# Altium project KorszeOBD.PrjPcb
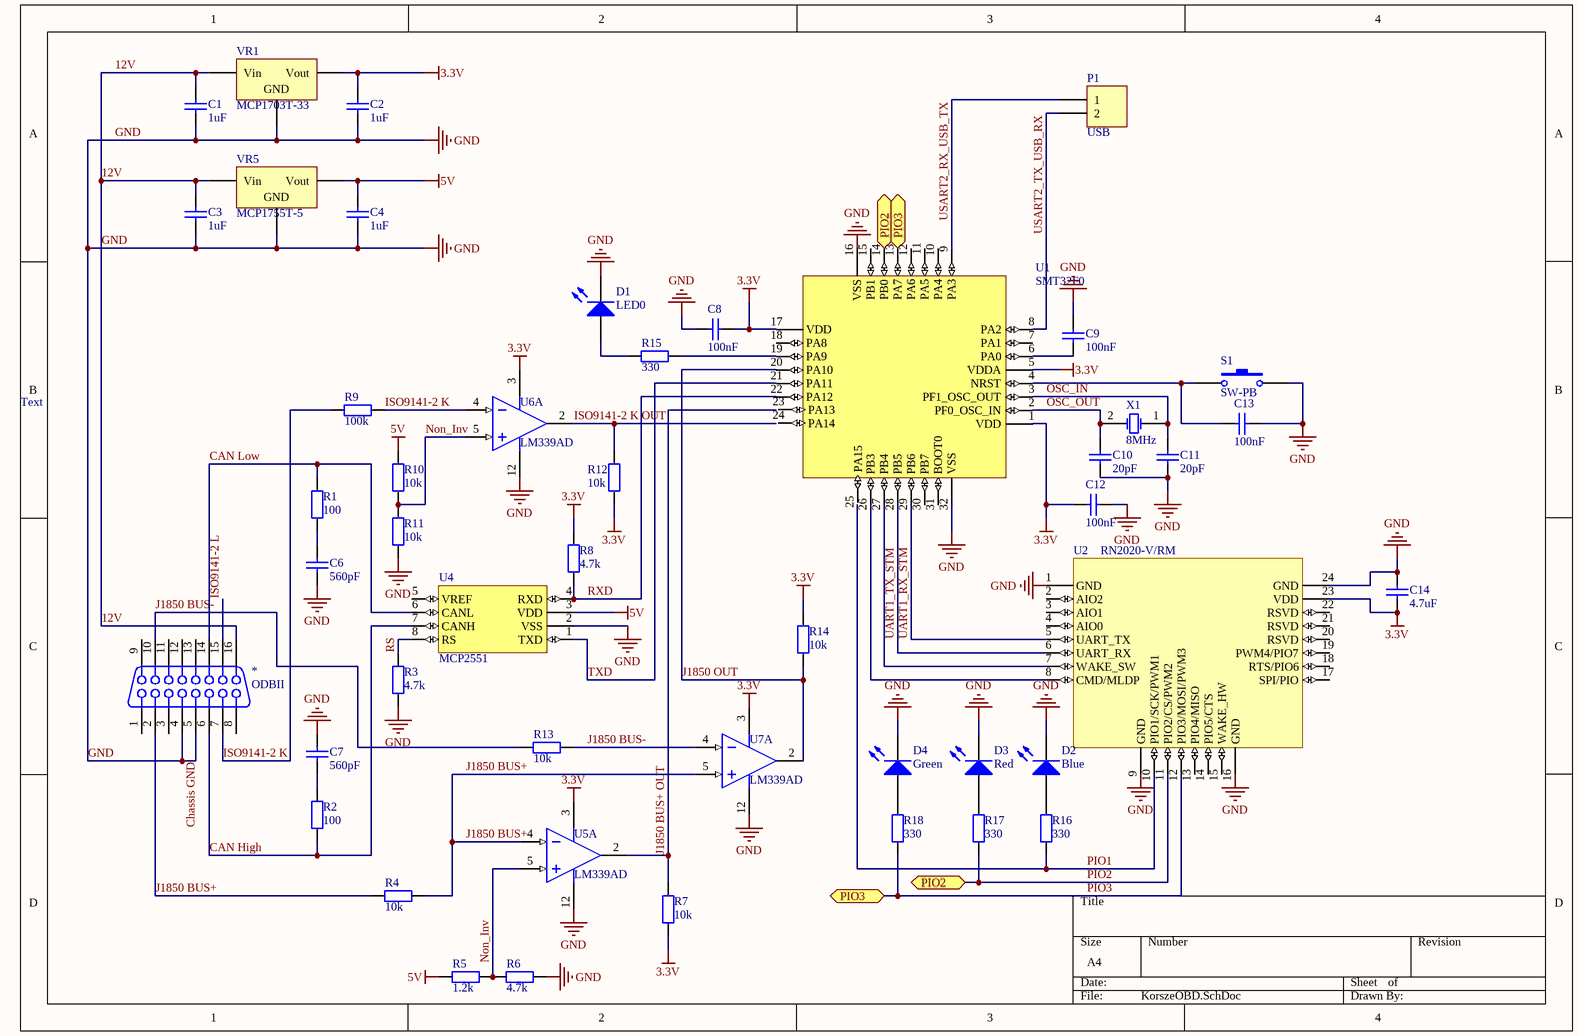
[diagram p0: KorszeOBD.SchDoc]
1 sheet, 47 parts. Net scope: flat (ports and power ports of the same name join across sheets).
Board file: KorszeOBD.PcbDoc

## Sheet KorszeOBD.SchDoc
size A4

### Parts
*  ODBII  [HDR2X8H]
C1  1uF  [0402]
C2  1uF  [0402]
C3  1uF  [0402]
C4  1uF  [0402]
C6  560pF  [0402]
C7  560pF  [0402]
C8  100nF  [0402]
C9  100nF  [0402]
C10  20pF  [0402]
C11  20pF  [0402]
C12  100nF  [0402]
C13  100nF  [0402]
C14  4.7uF  [0402]
D1  LED0  [3.2X1.6X1.1]
D2  Blue  [3.2X1.6X1.1]
D3  Red  [3.2X1.6X1.1]
D4  Green  [3.2X1.6X1.1]
P1  USB  [HDR1X2H]
R1  100  [J1-0603]
R2  100  [J1-0603]
R3  4.7k  [J1-0603]
R4  10k  [J1-0603]
R5  1.2k  [J1-0603]
R6  4.7k  [J1-0603]
R7  10k  [J1-0603]
R8  4.7k  [J1-0603]
R9  100k  [J1-0603]
R10  10k  [J1-0603]
R11  10k  [J1-0603]
R12  10k  [J1-0603]
R13  10k  [J1-0603]
R14  10k  [J1-0603]
R15  330  [J1-0603]
R16  330  [J1-0603]
R17  330  [J1-0603]
R18  330  [J1-0603]
S1  SW-PB  [SPST-2]
U1  SMT32F0  [Model Name]
U2  RN2020-V/RM  [RN4020 MODULE-24]
U4  MCP2551  [SO8W_M]
U5  LM339AD  [SO14_M]  (part A of 4)
U6  LM339AD  [SO14_M]  (part A of 4)
U7  LM339AD  [SO14_M]  (part A of 4)
VR1  MCP1703T-33  [SOT-23_M]
VR5  MCP1755T-5  [SOT23-6_M]
X1  8MHz  [R38]

### Ports
PIO2, PIO3

### Nets
3.3V: C2.2 C8.2 C12.2 C14.1 R7.2 R8.1 R12.2 R14.2 U1.1(VDD) U1.5(VDDA) U1.17(VDD) U2.23(VDD) U5.3(V+) U6.3(V+) U7.3(V+) VR1.3(Vout)
5V: C4.2 R5.2 R10.2 U4.3(VDD) VR5.3(Vout)
12V: *.4 *.5 *.16 C1.1 C1.2 C2.1 C3.1 C3.2 C4.1 C6.1 C7.2 C8.1 C9.2 C10.2 C11.2 C12.1 C13.2 C14.2 D1.2(K) D2.2(K) D3.2(K) D4.2(K) R3.1 R6.1 R11.1 S1.2 U1.16(VSS) U1.32(VSS) U2.1(GND) U2.9(GND) U2.16(GND) U2.24(GND) U4.2(VSS) U5.12(V-) U6.12(V-) U7.12(V-) VR1.1(Vin) VR1.2(GND) VR5.1(Vin) VR5.2(GND)  [also labelled Chassis GND, GND]
CAN High: *.6 R2.1 U4.7(CANH)
CAN Low: *.14 R1.2 U4.6(CANL)
ISO9141-2 K: *.7 R9.1 R9.2 U6.4(IN-)
ISO9141-2 K OUT: R12.1 U6.2(OUT)
ISO9141-2 L: *.15
J1850 BUS+: *.2 R4.1 R4.2 U5.4(IN-) U7.5(IN+)
J1850 BUS+ OUT: R7.1 U5.2(OUT)
J1850 BUS-: *.10 R13.1 R13.2 U7.4(IN-)
J1850 OUT: R14.1 U1.20(PA10) U7.2(OUT)
Non_Inv: R5.1 R6.2 R10.1 R11.2 U5.5(IN+) U6.5(IN+)
OSC_IN: C11.1 U1.3(PF1_OSC_OUT) X1.1(OSC1)
OSC_OUT: C10.1 U1.2(PF0_OSC_IN) X1.2(OSC2)
PIO1: R16.2 U2.10(PIO1/SCK/PWM1)
PIO2: R17.2 U1.14(PB0) U2.11(PIO2/CS/PWM2) ; port PIO2
PIO3: R18.2 U1.13(PA7) U2.12(PIO3/MOSI/PWM3) ; port PIO3
RS: R3.2 U4.8(RS)
RXD: R8.2 U1.22(PA12) U4.4(RXD)
TXD: U1.21(PA11) U4.1(TXD)
UART1_RX_STM: U1.29(PB6) U2.5(UART_TX)
UART1_TX_STM: U1.28(PB5) U2.6(UART_RX)
USART2_RX_USB_TX: P1.1 U1.9(PA3)
USART2_TX_USB_RX: P1.2 U1.8(PA2)
NetC6_2: C6.2 R1.1
NetC7_1: C7.1 R2.2
NetC9_1: C9.1 U1.6(PA0)
NetC13_1: C13.1 S1.1 U1.4(NRST)
NetD1_1: D1.1(A) R15.2
NetD2_1: D2.1(A) R16.1
NetD3_1: D3.1(A) R17.1
NetD4_1: D4.1(A) R18.1
NetR15_1: R15.1 U1.19(PA9)
NetU1_26: U1.26(PB3) U2.8(CMD/MLDP)
NetU1_27: U1.27(PB4) U2.7(WAKE_SW)

Not connected (* = marked no-connect by the designer): * 1 3 8 9 11 12 13; U1 7(PA1) 10(PA4) 11(PA5) 12(PA6) 15(PB1) 18(PA8) 23(PA13) 24(PA14) 25(PA15) 30(PB7) 31(BOOT0); U2 2(AIO2) 3(AIO1) 4(AIO0) 13(PIO4/MISO) 14(PIO5/CTS) 15(WAKE_HW) 17(SPI/PIO) 18(RTS/PIO6) 19(PWM4/PIO7) 20(RSVD) 21(RSVD) 22(RSVD); U4 5(VREF)

### Notes on the sheet
- Text

### Library data of the parts
C1-C4 C6-C9 C12-C14 = Cap: Capacitor; Published: 8-Jun-2000; LatestRevisionDate: 17-Jul-2002; LatestRevisionNote: Re-released for DXP Platform.; PackageReference: RAD-0.3; Publisher: Altium Limited; PackageDescription: Radial Cap, Thru-Hole; 2 Leads; 0.3 in Pin Spacing
  C1-C4: Value: 1uF
  C6 C7: Value: 560pF
  C8 C9 C12 C13: Value: 100nF
  C14: Value: 4.7uF
C10 C11 = Cap: Capacitor; Value: 4.3pF; Published: 8-Jun-2000; LatestRevisionDate: 17-Jul-2002; LatestRevisionNote: Re-released for DXP Platform.; PackageReference: RAD-0.3; Publisher: Altium Limited; PackageDescription: Radial Cap, Thru-Hole; 2 Leads; 0.3 in Pin Spacing
D1-D4 = LED0: Typical INFRARED GaAs LED; Published: 8-Jun-2000; LatestRevisionDate: 08-Jul-2005; LatestRevisionNote: Mech Layer 1 removed.; PackageReference: LED-0; Publisher: Altium Limited; PackageDescription: LED; 2 Leads
P1 = Header 2H: Header, 2-Pin, Right Angle; LatestRevisionDate: 17-Jul-2002; LatestRevisionNote: Re-released for DXP Platform.; Publisher: Altium Limited
R1-R8 R10-R18 = Res2: Resistor; Published: 8-Jun-2000; LatestRevisionDate: 17-Jul-2002; LatestRevisionNote: Re-released for DXP Platform.; PackageReference: AXIAL-0.4; Publisher: Altium Limited; PackageDescription: Axial Device, Thru-Hole; 2 Leads; 0.4 in Pin Spacing
  R1 R2: Value: 100
  R3 R6 R8: Value: 4.7k
  R4 R7 R10-R14: Value: 10k
  R5: Value: 1.2k
  R15-R18: Value: 330
R9 = Res2: Resistor; Value: 10k; Published: 8-Jun-2000; LatestRevisionDate: 17-Jul-2002; LatestRevisionNote: Re-released for DXP Platform.; PackageReference: AXIAL-0.4; Publisher: Altium Limited; PackageDescription: Axial Device, Thru-Hole; 2 Leads; 0.4 in Pin Spacing
S1 = SW-PB: Switch; Published: 24-Mar-1999; LatestRevisionDate: 17-Jul-2002; LatestRevisionNote: Re-released for DXP Platform.; PackageReference: SPST-2; Publisher: Altium Limited; PackageDescription: Switch; 2 Leads
U1 = STM32F030K6T6
U2 = RN2020-V/RM123: Microchip RN4020 Bluetooth
U4 = MCP2551-E/SN: CAN Transceiver Michrochip Technology MCP2551-E/SN
U5-U7 = LM339AD: Low-Power Quad Voltage Comparator; Published: 24-Aug-2001; LatestRevisionDate: 13-Apr-2006; LatestRevisionNote: IPC-7351 Footprint Added.; DatasheetVersion: Jun-1998; PackageVersion: Sep-1998; PackageReference: SO14; Publisher: Altium Limited; PackageDescription: 14-Pin Small Outline Integrated Circuit 1.27 mm Pitch; Code_IPC: SOIC127P600-14; ComponentLink1Description: Manufacturer Link; ComponentLink1URL: http://www.st.com/; ComponentLink2Description: Datasheet; ComponentLink2URL: http://www.st.com/stonline/products/literature/ds/2159/lm239.pdf
VR1 = Volt Reg: Voltage Regulator; pin to pad: 1>3 2>1 3>2; Published: 24-Mar-1999; LatestRevisionDate: 29-May-2009; LatestRevisionNote: IPC-7351 Footprint Added.; PackageReference: D2PAK; Publisher: Altium Limited; PackageDescription: 3-Pin Transistor Outline Package 2.54 mm Pitch, 15.1 mm Lead Span
VR5 = Volt Reg: Voltage Regulator; pin to pad: 3>6; Published: 24-Mar-1999; LatestRevisionDate: 29-May-2009; LatestRevisionNote: IPC-7351 Footprint Added.; PackageReference: D2PAK; Publisher: Altium Limited; PackageDescription: 3-Pin Transistor Outline Package 2.54 mm Pitch, 15.1 mm Lead Span
X1 = XTAL: Crystal Oscillator; Published: 8-Jun-2000; LatestRevisionDate: 17-Jul-2002; LatestRevisionNote: Re-released for DXP Platform.; PackageReference: R38; Publisher: Altium Limited; PackageDescription: Crystal, Thru-Hole; 2 Leads; Body 3.1 x 8.2 mm (Dia.xH)